# Altium schematic sheet Sheet1.SchDoc
size A4; SheetNumber: 1; SheetTotal: 1
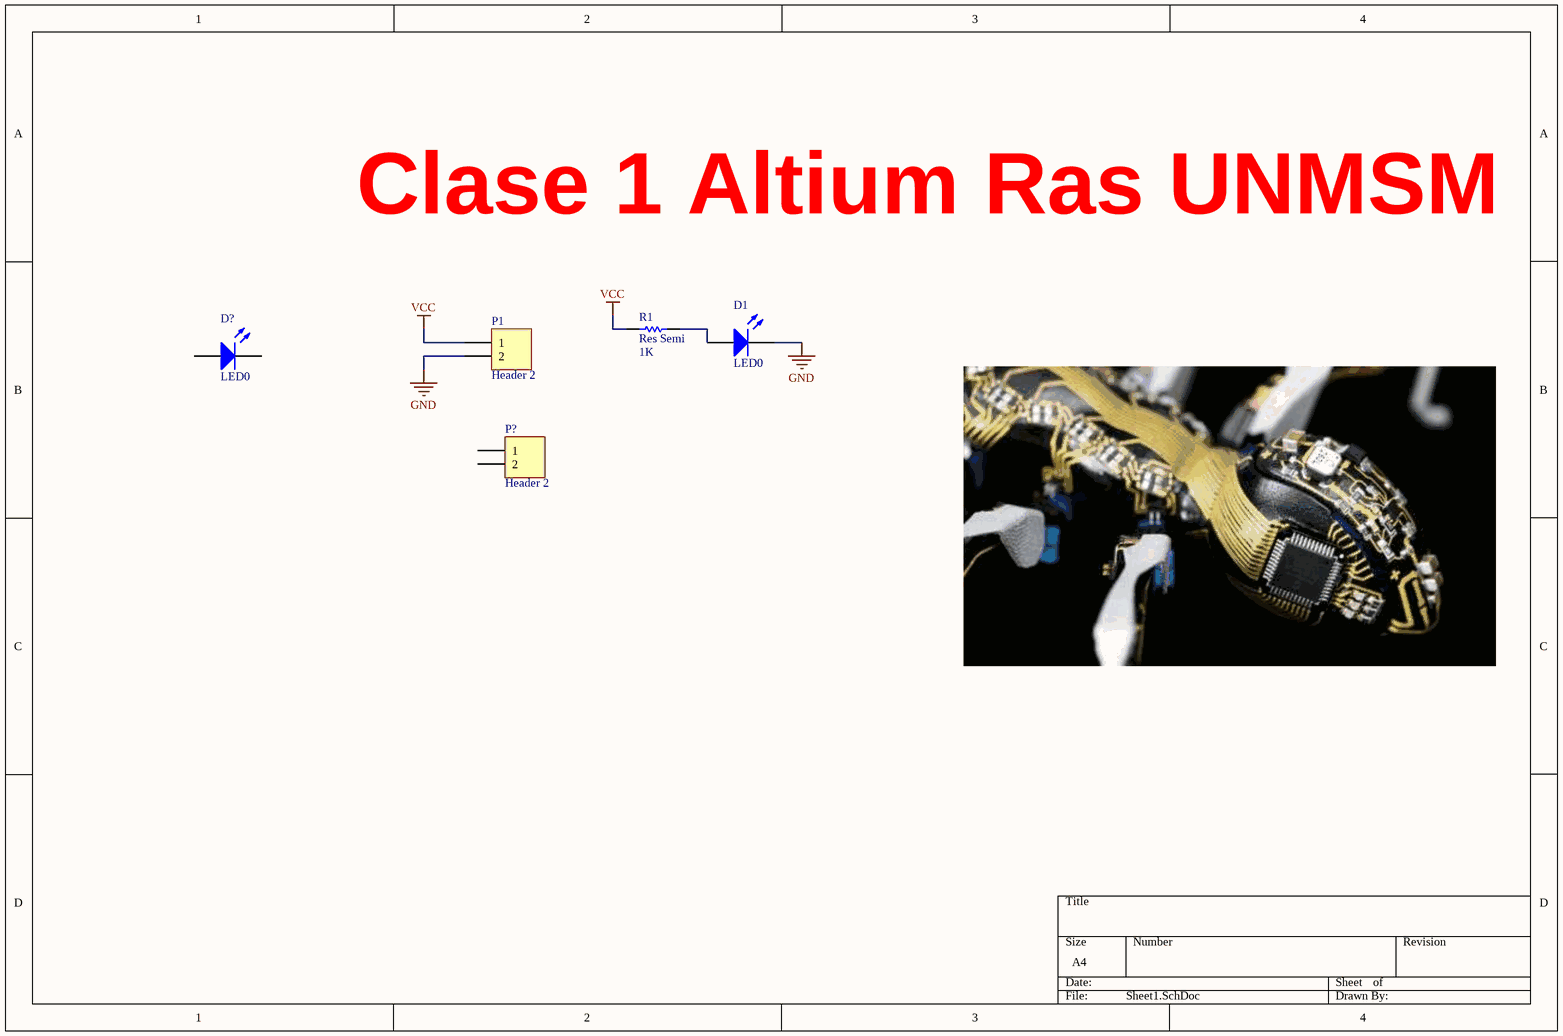
[diagram p0: Sheet1.SchDoc]

## Parts
D1  LED0  [LED-0]
D?  LED0  [LED-0]
P1  Header 2  [HDR1X2]
P?  Header 2  [HDR1X2]
R1  Res Semi  value 1K  [AXIAL-0.5]

## Nets
GND: D1.2(K) P1.2
VCC: P1.1 R1.1
NetD1_1: D1.1(A) R1.2

Not connected (* = marked no-connect by the designer): D? 1(A) 2(K); P? 1 2

## Notes on the sheet
- Clase 1 Altium Ras UNMSM

## Library data of the parts
D1 D? = LED0: Typical INFRARED GaAs LED; Published: 8-Jun-2000; LatestRevisionDate: 08-Jul-2005; LatestRevisionNote: Mech Layer 1 removed.; PackageReference: LED-0; Publisher: Altium Limited; PackageDescription: LED; 2 Leads
P1 P? = Header 2: Header, 2-Pin; LatestRevisionDate: 17-Jul-2002; LatestRevisionNote: Re-released for DXP Platform.; Publisher: Altium Limited
R1 = Res Semi: Semiconductor Resistor; Published: 8-Jun-2000; LatestRevisionDate: 17-Jul-2002; LatestRevisionNote: Re-released for DXP Platform.; PackageReference: AXIAL-0.5; Publisher: Altium Limited; PackageDescription: Axial Device, Thru-Hole; 2 Leads; 0.5 in Pin Spacing